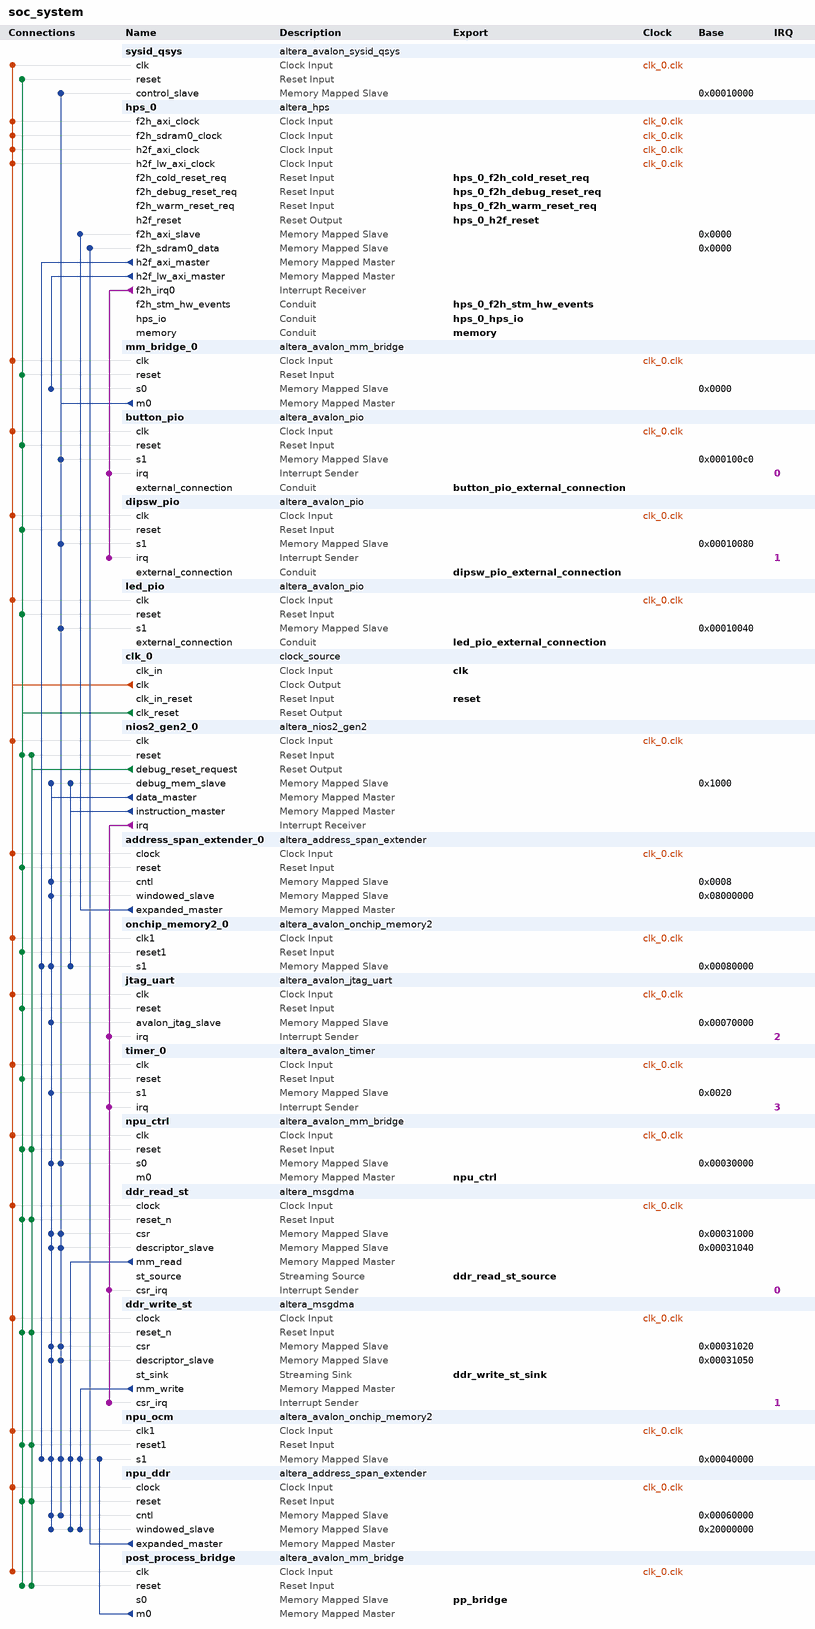
[diagram p0: system contents]
# Platform Designer (Qsys) system soc_system, Cyclone V 5CSEBA6U23I7
# Parameters at their usual value, and those the tool derives, are not listed.
package require -exact qsys 20.1
create_system soc_system
set_project_property DEVICE_FAMILY {Cyclone V}
set_project_property DEVICE 5CSEBA6U23I7

add_instance sysid_qsys altera_avalon_sysid_qsys 20.1
set_instance_parameter_value sysid_qsys id -1395322110

add_instance hps_0 altera_hps 20.1
set_instance_parameter_value hps_0 EMAC1_Mode RGMII
set_instance_parameter_value hps_0 EMAC1_PinMuxing {HPS I/O Set 0}
set_instance_parameter_value hps_0 F2SCLK_COLDRST_Enable true
set_instance_parameter_value hps_0 F2SCLK_DBGRST_Enable true
set_instance_parameter_value hps_0 F2SCLK_WARMRST_Enable true
set_instance_parameter_value hps_0 F2SDRAM_Type {Avalon-MM Bidirectional}
set_instance_parameter_value hps_0 F2SDRAM_Width 32
set_instance_parameter_value hps_0 F2SINTERRUPT_Enable true
set_instance_parameter_value hps_0 F2S_Width 2
set_instance_parameter_value hps_0 FPGA_PERIPHERAL_OUTPUT_CLOCK_FREQ_EMAC0_GTX_CLK 100
set_instance_parameter_value hps_0 FPGA_PERIPHERAL_OUTPUT_CLOCK_FREQ_EMAC0_MD_CLK 100.0
set_instance_parameter_value hps_0 FPGA_PERIPHERAL_OUTPUT_CLOCK_FREQ_EMAC1_GTX_CLK 100
set_instance_parameter_value hps_0 FPGA_PERIPHERAL_OUTPUT_CLOCK_FREQ_EMAC1_MD_CLK 100.0
set_instance_parameter_value hps_0 HPS_PROTOCOL DDR3
set_instance_parameter_value hps_0 I2C0_Mode I2C
set_instance_parameter_value hps_0 I2C0_PinMuxing {HPS I/O Set 0}
set_instance_parameter_value hps_0 I2C1_Mode I2C
set_instance_parameter_value hps_0 I2C1_PinMuxing {HPS I/O Set 0}
set_instance_parameter_value hps_0 LWH2F_Enable true
set_instance_parameter_value hps_0 MEM_BANKADDR_WIDTH 3
set_instance_parameter_value hps_0 MEM_CLK_FREQ 400.0
set_instance_parameter_value hps_0 MEM_COL_ADDR_WIDTH 10
set_instance_parameter_value hps_0 MEM_DQ_WIDTH 32
set_instance_parameter_value hps_0 MEM_DRV_STR RZQ/6
set_instance_parameter_value hps_0 MEM_ROW_ADDR_WIDTH 15
set_instance_parameter_value hps_0 MEM_RTT_NOM RZQ/6
set_instance_parameter_value hps_0 MEM_RTT_WR {Dynamic ODT off}
set_instance_parameter_value hps_0 MEM_TCL 7
set_instance_parameter_value hps_0 MEM_TFAW_NS 37.5
set_instance_parameter_value hps_0 MEM_TRAS_NS 35.0
set_instance_parameter_value hps_0 MEM_TRCD_NS 13.75
set_instance_parameter_value hps_0 MEM_TRFC_NS 300.0
set_instance_parameter_value hps_0 MEM_TRP_NS 13.75
set_instance_parameter_value hps_0 MEM_VENDOR Other
set_instance_parameter_value hps_0 MEM_WTCL 7
set_instance_parameter_value hps_0 QSPI_Mode N/A
set_instance_parameter_value hps_0 QSPI_PinMuxing Unused
set_instance_parameter_value hps_0 REF_CLK_FREQ 25.0
set_instance_parameter_value hps_0 S2FCLK_USER2CLK 4
set_instance_parameter_value hps_0 S2F_Width 2
set_instance_parameter_value hps_0 SDIO_Mode {4-bit Data}
set_instance_parameter_value hps_0 SDIO_PinMuxing {HPS I/O Set 0}
set_instance_parameter_value hps_0 SPIM1_Mode {Single Slave Select}
set_instance_parameter_value hps_0 SPIM1_PinMuxing {HPS I/O Set 0}
set_instance_parameter_value hps_0 STM_Enable true
set_instance_parameter_value hps_0 TIMING_BOARD_AC_SKEW 0.02
set_instance_parameter_value hps_0 TIMING_BOARD_AC_TO_CK_SKEW 0.0
set_instance_parameter_value hps_0 TIMING_BOARD_DQ_TO_DQS_SKEW 0.0
set_instance_parameter_value hps_0 TIMING_BOARD_MAX_CK_DELAY 0.6
set_instance_parameter_value hps_0 TIMING_BOARD_MAX_DQS_DELAY 0.6
set_instance_parameter_value hps_0 TIMING_BOARD_SKEW_BETWEEN_DQS 0.02
set_instance_parameter_value hps_0 TIMING_BOARD_SKEW_CKDQS_DIMM_MAX 0.01
set_instance_parameter_value hps_0 TIMING_BOARD_SKEW_CKDQS_DIMM_MIN -0.01
set_instance_parameter_value hps_0 TIMING_BOARD_SKEW_WITHIN_DQS 0.02
set_instance_parameter_value hps_0 TIMING_TDH 125
set_instance_parameter_value hps_0 TIMING_TDQSCK 400
set_instance_parameter_value hps_0 TIMING_TDQSQ 120
set_instance_parameter_value hps_0 TIMING_TDS 50
set_instance_parameter_value hps_0 TIMING_TIH 250
set_instance_parameter_value hps_0 TIMING_TIS 175
set_instance_parameter_value hps_0 TIMING_TQSH 0.38
set_instance_parameter_value hps_0 UART0_Mode {No Flow Control}
set_instance_parameter_value hps_0 UART0_PinMuxing {HPS I/O Set 0}
set_instance_parameter_value hps_0 USB1_Mode SDR
set_instance_parameter_value hps_0 USB1_PinMuxing {HPS I/O Set 0}
set_instance_parameter_value hps_0 desired_cfg_clk_mhz 100.0
set_instance_parameter_value hps_0 desired_qspi_clk_mhz 370.0

add_instance mm_bridge_0 altera_avalon_mm_bridge 20.1
set_instance_parameter_value mm_bridge_0 ADDRESS_UNITS SYMBOLS
set_instance_parameter_value mm_bridge_0 ADDRESS_WIDTH 10
set_instance_parameter_value mm_bridge_0 DATA_WIDTH 32
set_instance_parameter_value mm_bridge_0 MAX_PENDING_RESPONSES 4
set_instance_parameter_value mm_bridge_0 USE_AUTO_ADDRESS_WIDTH 1

add_instance button_pio altera_avalon_pio 20.1
set_instance_parameter_value button_pio bitClearingEdgeCapReg true
set_instance_parameter_value button_pio captureEdge true
set_instance_parameter_value button_pio direction Input
set_instance_parameter_value button_pio edgeType FALLING
set_instance_parameter_value button_pio generateIRQ true
set_instance_parameter_value button_pio irqType EDGE
set_instance_parameter_value button_pio width 2

add_instance dipsw_pio altera_avalon_pio 20.1
set_instance_parameter_value dipsw_pio bitClearingEdgeCapReg true
set_instance_parameter_value dipsw_pio captureEdge true
set_instance_parameter_value dipsw_pio direction Input
set_instance_parameter_value dipsw_pio edgeType ANY
set_instance_parameter_value dipsw_pio generateIRQ true
set_instance_parameter_value dipsw_pio irqType EDGE
set_instance_parameter_value dipsw_pio width 4

add_instance led_pio altera_avalon_pio 20.1
set_instance_parameter_value led_pio direction Output
set_instance_parameter_value led_pio width 7

add_instance clk_0 clock_source 20.1
set_instance_parameter_value clk_0 clockFrequency 50000000

add_instance nios2_gen2_0 altera_nios2_gen2 20.1
set_instance_parameter_value nios2_gen2_0 dcache_size 2048
set_instance_parameter_value nios2_gen2_0 exceptionSlave onchip_memory2_0.s1
set_instance_parameter_value nios2_gen2_0 icache_size 4096
set_instance_parameter_value nios2_gen2_0 impl Tiny
set_instance_parameter_value nios2_gen2_0 resetSlave onchip_memory2_0.s1

add_instance address_span_extender_0 altera_address_span_extender 20.1
set_instance_parameter_value address_span_extender_0 BURSTCOUNT_WIDTH 1
set_instance_parameter_value address_span_extender_0 DATA_WIDTH 32
set_instance_parameter_value address_span_extender_0 ENABLE_SLAVE_PORT true
set_instance_parameter_value address_span_extender_0 MASTER_ADDRESS_DEF 536870912
set_instance_parameter_value address_span_extender_0 MAX_PENDING_READS 1
set_instance_parameter_value address_span_extender_0 SLAVE_ADDRESS_WIDTH 25

add_instance onchip_memory2_0 altera_avalon_onchip_memory2 20.1
set_instance_parameter_value onchip_memory2_0 dataWidth 64
set_instance_parameter_value onchip_memory2_0 dualPort false
set_instance_parameter_value onchip_memory2_0 initMemContent true
set_instance_parameter_value onchip_memory2_0 initializationFileName onchip_memory2_0
set_instance_parameter_value onchip_memory2_0 memorySize 100000

add_instance jtag_uart altera_avalon_jtag_uart 20.1
set_instance_parameter_value jtag_uart allowMultipleConnections true
set_instance_parameter_value jtag_uart simInteractiveOptions INTERACTIVE_ASCII_OUTPUT

add_instance timer_0 altera_avalon_timer 20.1
set_instance_parameter_value timer_0 period 1
set_instance_parameter_value timer_0 periodUnits MSEC

add_instance npu_ctrl altera_avalon_mm_bridge 20.1
set_instance_parameter_value npu_ctrl ADDRESS_UNITS WORDS
set_instance_parameter_value npu_ctrl ADDRESS_WIDTH 10
set_instance_parameter_value npu_ctrl DATA_WIDTH 32
set_instance_parameter_value npu_ctrl MAX_PENDING_RESPONSES 4
set_instance_parameter_value npu_ctrl USE_AUTO_ADDRESS_WIDTH 0

add_instance ddr_read_st altera_msgdma 20.1
set_instance_parameter_value ddr_read_st BURST_ENABLE 1
set_instance_parameter_value ddr_read_st DATA_FIFO_DEPTH 128
set_instance_parameter_value ddr_read_st DATA_WIDTH 64
set_instance_parameter_value ddr_read_st DESCRIPTOR_FIFO_DEPTH 128
set_instance_parameter_value ddr_read_st ENHANCED_FEATURES 0
set_instance_parameter_value ddr_read_st ERROR_ENABLE 0
set_instance_parameter_value ddr_read_st MAX_BURST_COUNT 16
set_instance_parameter_value ddr_read_st MAX_BYTE 1048576
set_instance_parameter_value ddr_read_st MODE 1
set_instance_parameter_value ddr_read_st PACKET_ENABLE 1
set_instance_parameter_value ddr_read_st TRANSFER_TYPE {Aligned Accesses}

add_instance ddr_write_st altera_msgdma 20.1
set_instance_parameter_value ddr_write_st BURST_ENABLE 1
set_instance_parameter_value ddr_write_st DATA_FIFO_DEPTH 128
set_instance_parameter_value ddr_write_st DATA_WIDTH 64
set_instance_parameter_value ddr_write_st DESCRIPTOR_FIFO_DEPTH 128
set_instance_parameter_value ddr_write_st ENHANCED_FEATURES 0
set_instance_parameter_value ddr_write_st ERROR_ENABLE 0
set_instance_parameter_value ddr_write_st MAX_BURST_COUNT 16
set_instance_parameter_value ddr_write_st MAX_BYTE 1048576
set_instance_parameter_value ddr_write_st MODE 2
set_instance_parameter_value ddr_write_st PACKET_ENABLE 1
set_instance_parameter_value ddr_write_st TRANSFER_TYPE {Aligned Accesses}

add_instance npu_ocm altera_avalon_onchip_memory2 20.1
set_instance_parameter_value npu_ocm dataWidth 32
set_instance_parameter_value npu_ocm dualPort false
set_instance_parameter_value npu_ocm initMemContent true
set_instance_parameter_value npu_ocm initializationFileName onchip_mem.hex
set_instance_parameter_value npu_ocm memorySize 131072

add_instance npu_ddr altera_address_span_extender 20.1
set_instance_parameter_value npu_ddr BURSTCOUNT_WIDTH 8
set_instance_parameter_value npu_ddr DATA_WIDTH 32
set_instance_parameter_value npu_ddr ENABLE_SLAVE_PORT true
set_instance_parameter_value npu_ddr MASTER_ADDRESS_DEF 536870912
set_instance_parameter_value npu_ddr MAX_PENDING_READS 1
set_instance_parameter_value npu_ddr SLAVE_ADDRESS_WIDTH 27

add_instance post_process_bridge altera_avalon_mm_bridge 20.1
set_instance_parameter_value post_process_bridge ADDRESS_UNITS SYMBOLS
set_instance_parameter_value post_process_bridge ADDRESS_WIDTH 10
set_instance_parameter_value post_process_bridge DATA_WIDTH 32
set_instance_parameter_value post_process_bridge MAX_BURST_SIZE 32
set_instance_parameter_value post_process_bridge MAX_PENDING_RESPONSES 4
set_instance_parameter_value post_process_bridge USE_AUTO_ADDRESS_WIDTH 1

# connections
add_connection clk_0.clk address_span_extender_0.clock clock
add_connection clk_0.clk button_pio.clk clock
add_connection clk_0.clk ddr_read_st.clock clock
add_connection clk_0.clk ddr_write_st.clock clock
add_connection clk_0.clk dipsw_pio.clk clock
add_connection clk_0.clk hps_0.f2h_axi_clock clock
add_connection clk_0.clk hps_0.f2h_sdram0_clock clock
add_connection clk_0.clk hps_0.h2f_axi_clock clock
add_connection clk_0.clk hps_0.h2f_lw_axi_clock clock
add_connection clk_0.clk jtag_uart.clk clock
add_connection clk_0.clk led_pio.clk clock
add_connection clk_0.clk mm_bridge_0.clk clock
add_connection clk_0.clk nios2_gen2_0.clk clock
add_connection clk_0.clk npu_ctrl.clk clock
add_connection clk_0.clk npu_ddr.clock clock
add_connection clk_0.clk npu_ocm.clk1 clock
add_connection clk_0.clk onchip_memory2_0.clk1 clock
add_connection clk_0.clk post_process_bridge.clk clock
add_connection clk_0.clk sysid_qsys.clk clock
add_connection clk_0.clk timer_0.clk clock
add_connection clk_0.clk_reset address_span_extender_0.reset reset
add_connection clk_0.clk_reset button_pio.reset reset
add_connection clk_0.clk_reset ddr_read_st.reset_n reset
add_connection clk_0.clk_reset ddr_write_st.reset_n reset
add_connection clk_0.clk_reset dipsw_pio.reset reset
add_connection clk_0.clk_reset jtag_uart.reset reset
add_connection clk_0.clk_reset led_pio.reset reset
add_connection clk_0.clk_reset mm_bridge_0.reset reset
add_connection clk_0.clk_reset nios2_gen2_0.reset reset
add_connection clk_0.clk_reset npu_ctrl.reset reset
add_connection clk_0.clk_reset npu_ddr.reset reset
add_connection clk_0.clk_reset npu_ocm.reset1 reset
add_connection clk_0.clk_reset onchip_memory2_0.reset1 reset
add_connection clk_0.clk_reset post_process_bridge.reset reset
add_connection clk_0.clk_reset sysid_qsys.reset reset
add_connection clk_0.clk_reset timer_0.reset reset
add_connection nios2_gen2_0.debug_reset_request ddr_read_st.reset_n reset
add_connection nios2_gen2_0.debug_reset_request ddr_write_st.reset_n reset
add_connection nios2_gen2_0.debug_reset_request nios2_gen2_0.reset reset
add_connection nios2_gen2_0.debug_reset_request npu_ctrl.reset reset
add_connection nios2_gen2_0.debug_reset_request npu_ddr.reset reset
add_connection nios2_gen2_0.debug_reset_request npu_ocm.reset1 reset
add_connection nios2_gen2_0.debug_reset_request post_process_bridge.reset reset
add_connection address_span_extender_0.expanded_master hps_0.f2h_axi_slave avalon
set_connection_parameter_value address_span_extender_0.expanded_master/hps_0.f2h_axi_slave baseAddress 0x0000
add_connection ddr_read_st.mm_read npu_ddr.windowed_slave avalon
set_connection_parameter_value ddr_read_st.mm_read/npu_ddr.windowed_slave baseAddress 0x20000000
add_connection ddr_read_st.mm_read npu_ocm.s1 avalon
set_connection_parameter_value ddr_read_st.mm_read/npu_ocm.s1 baseAddress 0x00040000
add_connection ddr_write_st.mm_write npu_ddr.windowed_slave avalon
set_connection_parameter_value ddr_write_st.mm_write/npu_ddr.windowed_slave baseAddress 0x20000000
add_connection ddr_write_st.mm_write npu_ocm.s1 avalon
set_connection_parameter_value ddr_write_st.mm_write/npu_ocm.s1 baseAddress 0x00040000
add_connection hps_0.h2f_axi_master npu_ocm.s1 avalon
set_connection_parameter_value hps_0.h2f_axi_master/npu_ocm.s1 baseAddress 0x00040000
add_connection hps_0.h2f_axi_master onchip_memory2_0.s1 avalon
set_connection_parameter_value hps_0.h2f_axi_master/onchip_memory2_0.s1 baseAddress 0x00080000
add_connection hps_0.h2f_lw_axi_master mm_bridge_0.s0 avalon
set_connection_parameter_value hps_0.h2f_lw_axi_master/mm_bridge_0.s0 baseAddress 0x0000
add_connection mm_bridge_0.m0 button_pio.s1 avalon
set_connection_parameter_value mm_bridge_0.m0/button_pio.s1 baseAddress 0x000100c0
add_connection mm_bridge_0.m0 ddr_read_st.csr avalon
set_connection_parameter_value mm_bridge_0.m0/ddr_read_st.csr baseAddress 0x00031000
add_connection mm_bridge_0.m0 ddr_read_st.descriptor_slave avalon
set_connection_parameter_value mm_bridge_0.m0/ddr_read_st.descriptor_slave baseAddress 0x00031040
add_connection mm_bridge_0.m0 ddr_write_st.csr avalon
set_connection_parameter_value mm_bridge_0.m0/ddr_write_st.csr baseAddress 0x00031020
add_connection mm_bridge_0.m0 ddr_write_st.descriptor_slave avalon
set_connection_parameter_value mm_bridge_0.m0/ddr_write_st.descriptor_slave baseAddress 0x00031050
add_connection mm_bridge_0.m0 dipsw_pio.s1 avalon
set_connection_parameter_value mm_bridge_0.m0/dipsw_pio.s1 baseAddress 0x00010080
add_connection mm_bridge_0.m0 led_pio.s1 avalon
set_connection_parameter_value mm_bridge_0.m0/led_pio.s1 baseAddress 0x00010040
add_connection mm_bridge_0.m0 npu_ctrl.s0 avalon
set_connection_parameter_value mm_bridge_0.m0/npu_ctrl.s0 baseAddress 0x00030000
add_connection mm_bridge_0.m0 npu_ddr.cntl avalon
set_connection_parameter_value mm_bridge_0.m0/npu_ddr.cntl baseAddress 0x00060000
add_connection mm_bridge_0.m0 npu_ocm.s1 avalon
set_connection_parameter_value mm_bridge_0.m0/npu_ocm.s1 baseAddress 0x00040000
add_connection mm_bridge_0.m0 sysid_qsys.control_slave avalon
set_connection_parameter_value mm_bridge_0.m0/sysid_qsys.control_slave baseAddress 0x00010000
add_connection nios2_gen2_0.data_master address_span_extender_0.cntl avalon
set_connection_parameter_value nios2_gen2_0.data_master/address_span_extender_0.cntl baseAddress 0x0008
add_connection nios2_gen2_0.data_master address_span_extender_0.windowed_slave avalon
set_connection_parameter_value nios2_gen2_0.data_master/address_span_extender_0.windowed_slave baseAddress 0x08000000
add_connection nios2_gen2_0.data_master ddr_read_st.csr avalon
set_connection_parameter_value nios2_gen2_0.data_master/ddr_read_st.csr baseAddress 0x00031000
add_connection nios2_gen2_0.data_master ddr_read_st.descriptor_slave avalon
set_connection_parameter_value nios2_gen2_0.data_master/ddr_read_st.descriptor_slave baseAddress 0x00031040
add_connection nios2_gen2_0.data_master ddr_write_st.csr avalon
set_connection_parameter_value nios2_gen2_0.data_master/ddr_write_st.csr baseAddress 0x00031020
add_connection nios2_gen2_0.data_master ddr_write_st.descriptor_slave avalon
set_connection_parameter_value nios2_gen2_0.data_master/ddr_write_st.descriptor_slave baseAddress 0x00031050
add_connection nios2_gen2_0.data_master jtag_uart.avalon_jtag_slave avalon
set_connection_parameter_value nios2_gen2_0.data_master/jtag_uart.avalon_jtag_slave baseAddress 0x00070000
add_connection nios2_gen2_0.data_master nios2_gen2_0.debug_mem_slave avalon
set_connection_parameter_value nios2_gen2_0.data_master/nios2_gen2_0.debug_mem_slave baseAddress 0x1000
add_connection nios2_gen2_0.data_master npu_ctrl.s0 avalon
set_connection_parameter_value nios2_gen2_0.data_master/npu_ctrl.s0 baseAddress 0x00030000
add_connection nios2_gen2_0.data_master npu_ddr.cntl avalon
set_connection_parameter_value nios2_gen2_0.data_master/npu_ddr.cntl baseAddress 0x00060000
add_connection nios2_gen2_0.data_master npu_ddr.windowed_slave avalon
set_connection_parameter_value nios2_gen2_0.data_master/npu_ddr.windowed_slave baseAddress 0x20000000
add_connection nios2_gen2_0.data_master npu_ocm.s1 avalon
set_connection_parameter_value nios2_gen2_0.data_master/npu_ocm.s1 baseAddress 0x00040000
add_connection nios2_gen2_0.data_master onchip_memory2_0.s1 avalon
set_connection_parameter_value nios2_gen2_0.data_master/onchip_memory2_0.s1 baseAddress 0x00080000
add_connection nios2_gen2_0.data_master timer_0.s1 avalon
set_connection_parameter_value nios2_gen2_0.data_master/timer_0.s1 baseAddress 0x0020
add_connection nios2_gen2_0.instruction_master nios2_gen2_0.debug_mem_slave avalon
set_connection_parameter_value nios2_gen2_0.instruction_master/nios2_gen2_0.debug_mem_slave baseAddress 0x1000
add_connection nios2_gen2_0.instruction_master onchip_memory2_0.s1 avalon
set_connection_parameter_value nios2_gen2_0.instruction_master/onchip_memory2_0.s1 baseAddress 0x00080000
add_connection npu_ddr.expanded_master hps_0.f2h_sdram0_data avalon
set_connection_parameter_value npu_ddr.expanded_master/hps_0.f2h_sdram0_data baseAddress 0x0000
add_connection post_process_bridge.m0 npu_ocm.s1 avalon
set_connection_parameter_value post_process_bridge.m0/npu_ocm.s1 baseAddress 0x00040000
add_connection hps_0.f2h_irq0 button_pio.irq interrupt
set_connection_parameter_value hps_0.f2h_irq0/button_pio.irq irqNumber 0
add_connection hps_0.f2h_irq0 dipsw_pio.irq interrupt
set_connection_parameter_value hps_0.f2h_irq0/dipsw_pio.irq irqNumber 1
add_connection nios2_gen2_0.irq ddr_read_st.csr_irq interrupt
set_connection_parameter_value nios2_gen2_0.irq/ddr_read_st.csr_irq irqNumber 0
add_connection nios2_gen2_0.irq ddr_write_st.csr_irq interrupt
set_connection_parameter_value nios2_gen2_0.irq/ddr_write_st.csr_irq irqNumber 1
add_connection nios2_gen2_0.irq jtag_uart.irq interrupt
set_connection_parameter_value nios2_gen2_0.irq/jtag_uart.irq irqNumber 2
add_connection nios2_gen2_0.irq timer_0.irq interrupt
set_connection_parameter_value nios2_gen2_0.irq/timer_0.irq irqNumber 3

# exported interfaces
add_interface button_pio_external_connection conduit end
set_interface_property button_pio_external_connection EXPORT_OF button_pio.external_connection
add_interface clk clock sink
set_interface_property clk EXPORT_OF clk_0.clk_in
add_interface ddr_read_st_source avalon_streaming source
set_interface_property ddr_read_st_source EXPORT_OF ddr_read_st.st_source
add_interface ddr_write_st_sink avalon_streaming sink
set_interface_property ddr_write_st_sink EXPORT_OF ddr_write_st.st_sink
add_interface dipsw_pio_external_connection conduit end
set_interface_property dipsw_pio_external_connection EXPORT_OF dipsw_pio.external_connection
add_interface hps_0_f2h_cold_reset_req reset sink
set_interface_property hps_0_f2h_cold_reset_req EXPORT_OF hps_0.f2h_cold_reset_req
add_interface hps_0_f2h_debug_reset_req reset sink
set_interface_property hps_0_f2h_debug_reset_req EXPORT_OF hps_0.f2h_debug_reset_req
add_interface hps_0_f2h_stm_hw_events conduit end
set_interface_property hps_0_f2h_stm_hw_events EXPORT_OF hps_0.f2h_stm_hw_events
add_interface hps_0_f2h_warm_reset_req reset sink
set_interface_property hps_0_f2h_warm_reset_req EXPORT_OF hps_0.f2h_warm_reset_req
add_interface hps_0_h2f_reset reset source
set_interface_property hps_0_h2f_reset EXPORT_OF hps_0.h2f_reset
add_interface hps_0_hps_io conduit end
set_interface_property hps_0_hps_io EXPORT_OF hps_0.hps_io
add_interface led_pio_external_connection conduit end
set_interface_property led_pio_external_connection EXPORT_OF led_pio.external_connection
add_interface memory conduit end
set_interface_property memory EXPORT_OF hps_0.memory
add_interface npu_ctrl avalon master
set_interface_property npu_ctrl EXPORT_OF npu_ctrl.m0
add_interface pp_bridge avalon slave
set_interface_property pp_bridge EXPORT_OF post_process_bridge.s0
add_interface reset reset sink
set_interface_property reset EXPORT_OF clk_0.clk_in_reset

set_interconnect_requirement {$system} qsys_mm.clockCrossingAdapter HANDSHAKE
set_interconnect_requirement {$system} qsys_mm.maxAdditionalLatency 1

save_system soc_system.qsys
